# EasyEDA Pro project ProPrj_DBE MosFet_15F_2025-01-06.epro

# Schematic DBE MosFet
Board Name: DBE MosFet; Create Date: 2024-11-29; Page Name: DBE PCB; Project Name: DBE MosFet_15F; Schematic Name: DBE MosFet; Update Date: 2024-11-30; Add into BOM: yes; Company: BarBarian; Convert to PCB: yes; Date: 2024-05-22; Draw By: syncbart; REV: 1.4; Sheet: 1/1
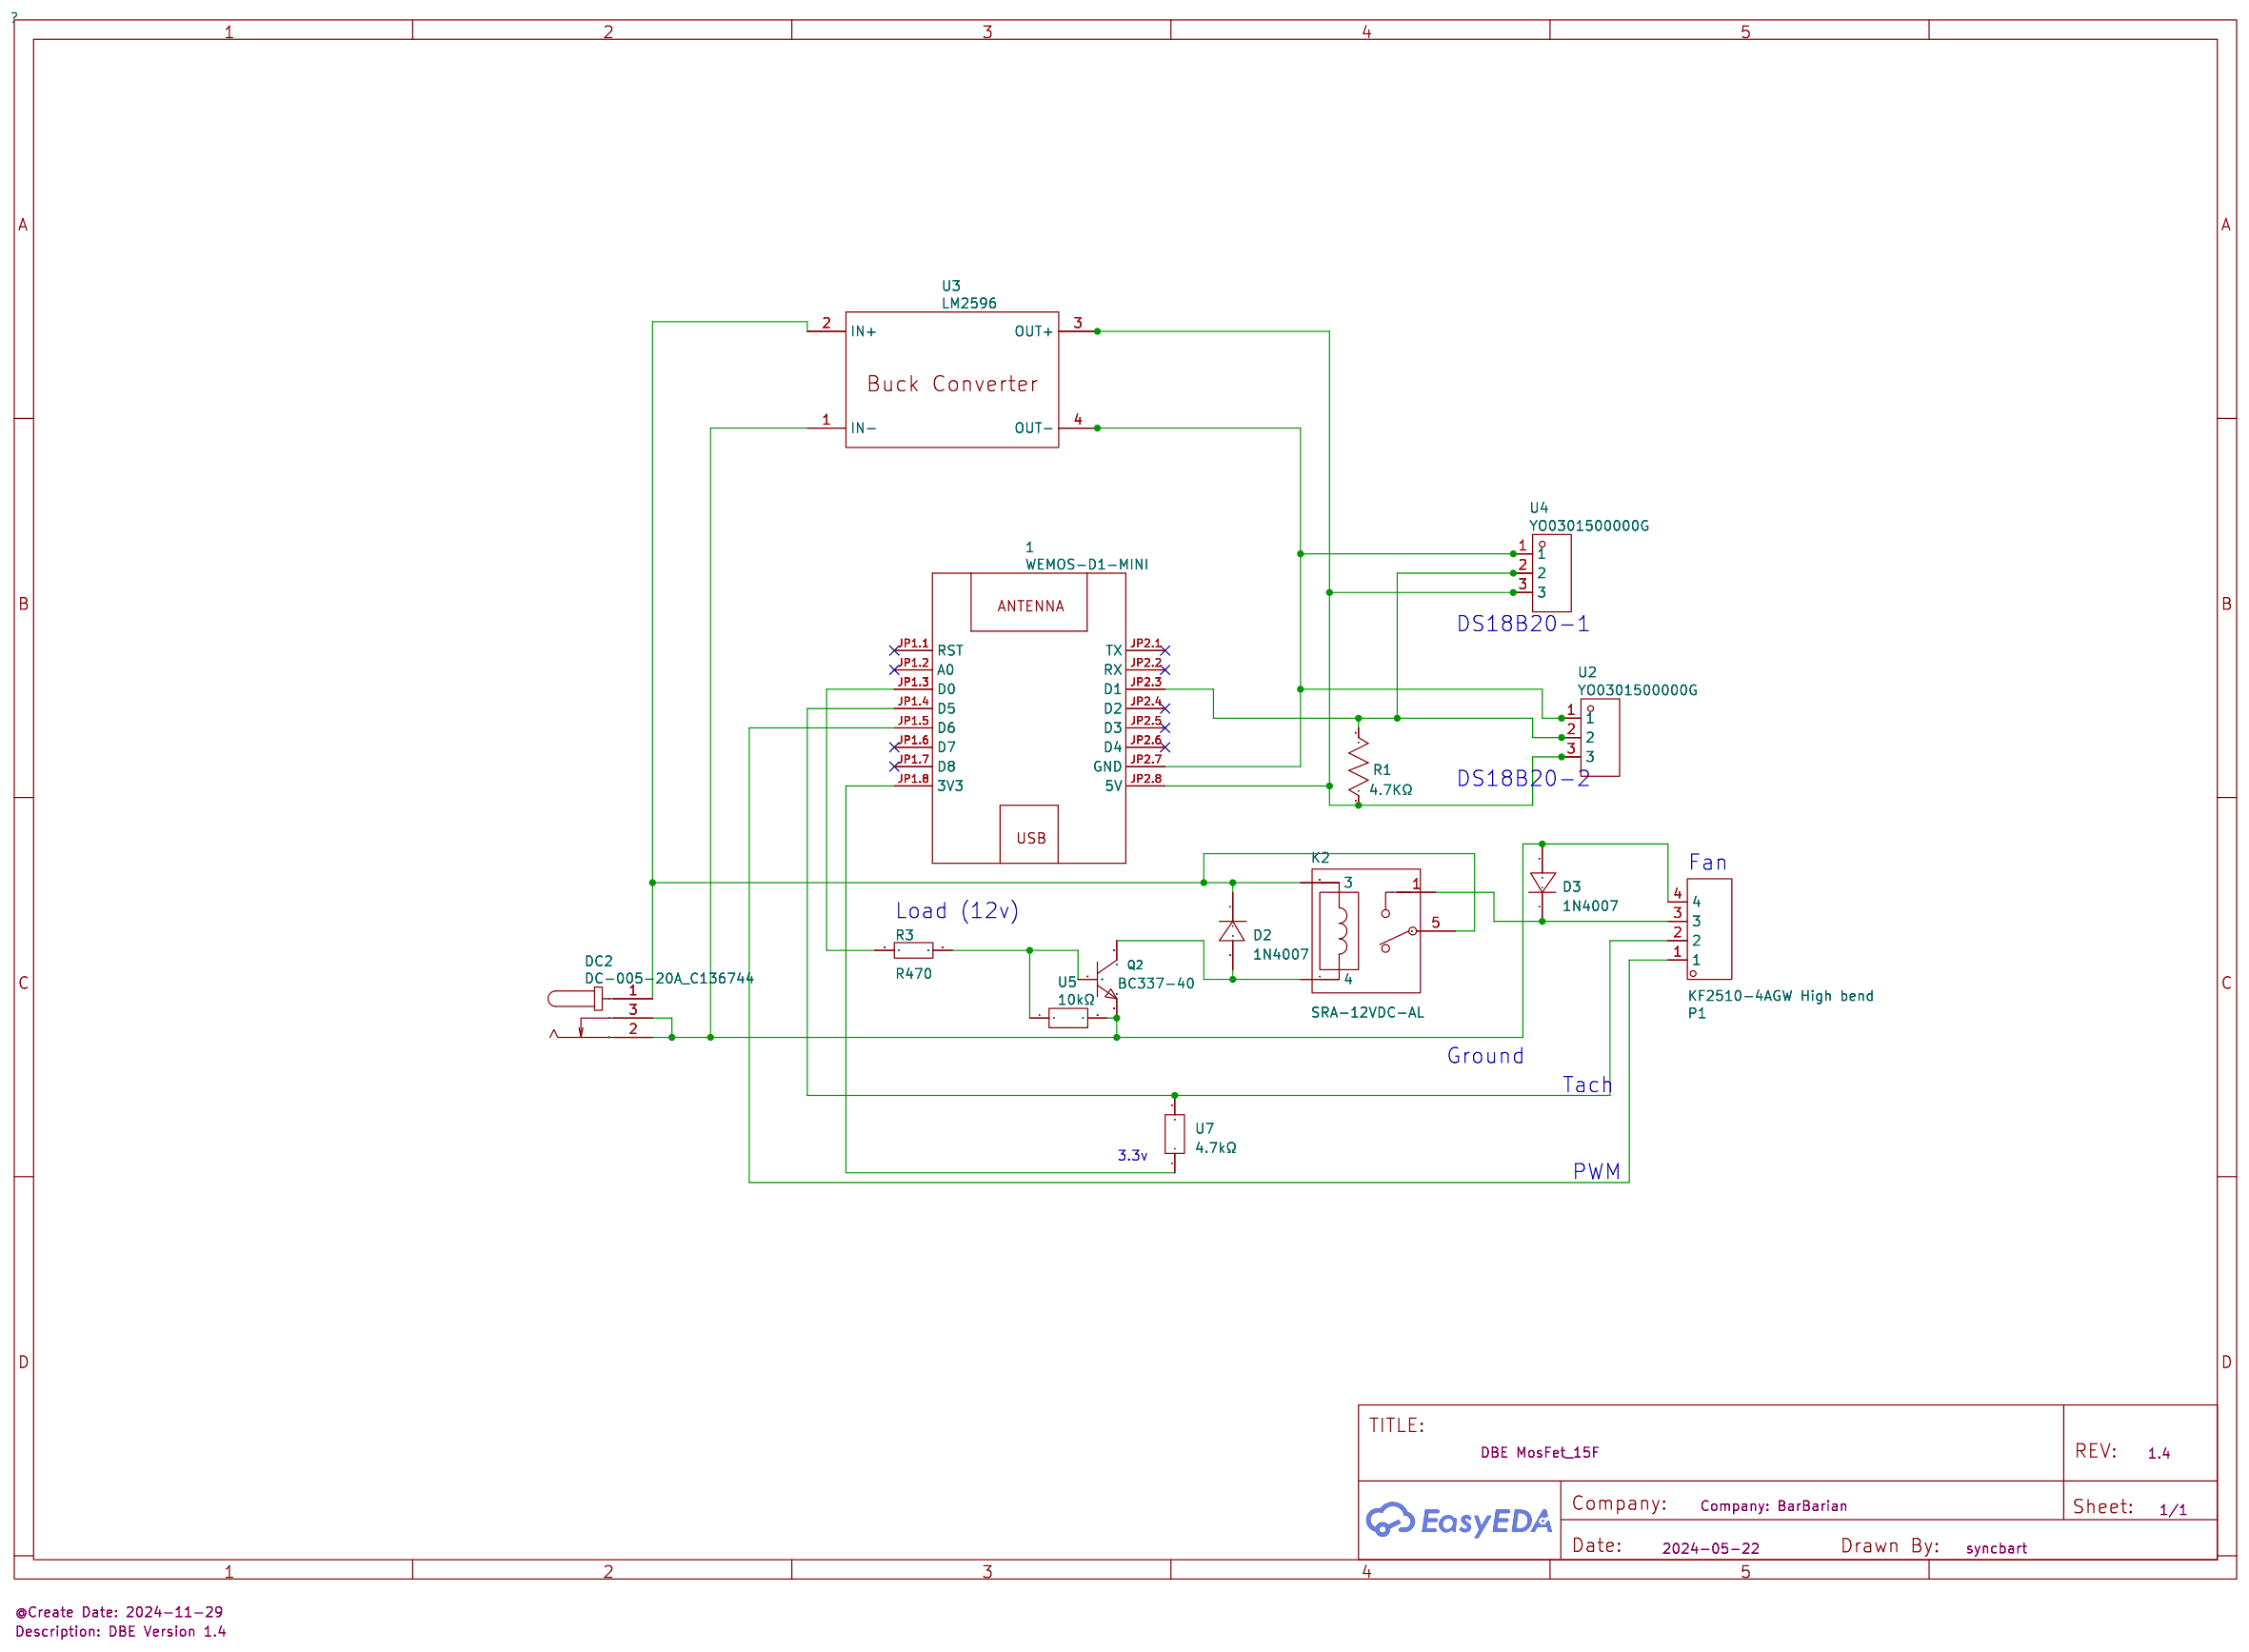
[diagram p0: schematic sheet]

## Parts
1  WEMOS-D1-MINI  [WEMOS-D1-MINI]
D2  1N4007  [DO-41_BD2.4-L4.7-P8.70-D0.9-RD]
D3  1N4007  [DO-41_BD2.4-L4.7-P8.70-D0.9-RD]
DC2  DC-005-20A_C136744  [DC-IN-TH_DC-005-20A]
K2  SRA-12VDC-AL  [RELAY-TH_SRA-XXVDC-AL]
P1  KF2510-4AGW High bend  [CONN-TH_KF2510-4AGW]
Q2  BC337-40  [TO-92-3_L4.9-W3.7-P1.27-L]
R1  4.7KΩ  [R0603]
R3  300mΩ  [R2512]
U2  YO0301500000G  [CONN-TH_YO0301500000G]
U3  LM2596  [LM2596]
U4  YO0301500000G  [CONN-TH_YO0301500000G]
U5  10kΩ  [R1206]
U7  4.7kΩ  [RES-TH_BD2.4-L6.3-P10.30-D0.6]

## Library data of the parts
1 = WEMOS-D1-MINI
D2 D3 = 1N4007: Supplier: LCSC; Manufacturer: ST(先科); Supplier Part: C106903; JLCPCB Part Class: Extended Part
DC2 = DC-005-20A_C136744: Supplier: LCSC; Manufacturer: 韩国韩荣; Manufacturer Part: DC-005-20A; Supplier Part: C136744; JLCPCB Part Class: Extended Part
K2 = SRA-12VDC-AL: Coil Voltage:12V Coil Type:非极化-单线圈 Pin Number:4 Contact Form:一组常开:1A(SPST-常开) Maximum Switching Current:10A Maximum Switching Voltage:125V@AC Coil Rated Power:600mW Contact Rating:20A@14VAC；10A@125VAC Coil Resistance:240Ω Operate Time:10ms Release Time:10; Supplier: LCSC; Manufacturer: 松乐; Supplier Part: C86414; JLCPCB Part Class: Extended Part; LCSC Part Name: SRA-12VDC-AL 黑色; Supplier Footprint: 插件,12.4x16mm; Datasheet: https://atta.szlcsc.com/upload/public/pdf/source/20180525/C86414_647190E70CCED65E88773AC191420885.pdf; Coil Voltage: 12V; Coil Type: 非极化-单线圈; Pin Number: 4; Contact Form: 一组常开:1A(SPST-常开); Maximum Switching Current: 10A; Maximum Switching Voltage: 125V@AC; Coil Rated Power: 600mW; Contact Rating: 20A@14VAC；10A@125VAC; Coil Resistance: 240Ω; Operate Time: 10ms; Release Time: 10ms; Contact Resistance: 100mΩ; Operating Temperature: -40℃~+85℃
P1 = KF2510-4AGW High bend: Supplier: LCSC; Manufacturer: BOOMELE(博穆精密); Manufacturer Part: 2510-4A高弯; Supplier Part: C61409; JLCPCB Part Class: Extended Part
Q2 = BC337-40: Transistor Type: Collector Current (Ic): Collector-Emitter Breakdown Voltage (Vceo): Power Dissipation (Pd): DC Current Gain (hFE@Ic,Vce):250@100mA,1V DC Current Gain (hFE@Ic,Vce):250@100mA,1V Transition Frequency (fT):210MHz Collector Cut-Off Current (Ic; LCSC Part Name: NPN 电流:800mA 耐压:45V; Supplier Part: C713611; Manufacturer: LGE(鲁光); Supplier Footprint: TO-92-3; JLCPCB Part Class: Extended Part; Datasheet: https://atta.szlcsc.com/upload/public/pdf/source/20200731/C713609_2BF9102A3EBD29C1F5C6CEBDB020064D.pdf; Supplier: LCSC; DC Current Gain (hFE@Ic,Vce): 250@100mA,1V; Transition Frequency (fT): 210MHz; Collector Cut-Off Current (Icbo): 100nA; Collector-Emitter Saturation Voltage (VCE(sat)@Ic,Ib): 700mV@500mA,50mA
R1 = 4.7KΩ
R3 = SR73W3ATTER300F: Resistance: Tolerance:±1% Tolerance:±1% Power(Watts): Temperature Coefficient:±100ppm/℃ Temperature Coefficient:±100ppm/℃; LCSC Part Name: 300mΩ ±1% 1W; Supplier Part: C186683; Manufacturer: KOA; Supplier Footprint: 2512; JLCPCB Part Class: Extended Part; Datasheet: https://atta.szlcsc.com/upload/public/pdf/source/20180412/C186696_56DBC868BCE53E89FE8EB87A2B584B46.pdf; Supplier: LCSC; Tolerance: ±1%; Temperature Coefficient: ±100ppm/℃
U2 U4 = YO0301500000G: Supplier: LCSC; Supplier Part: C2683167; Manufacturer: Amphenol; JLCPCB Part Class: Extended Part; link: https://lcsc.com/eda_search?q=C2683167&amp;%26type=1&amp;ref=editor
U3 = LM2596
U5 = 10kΩ: Supplier: LCSC; Supplier Part: C5141115; Manufacturer: RALEC(旺诠); Manufacturer Part: RTX061002BDTP
U7 = MFR-25FBF52-13K3: Type:Metal Film Resistors Resistance: Tolerance:±1% Tolerance:±1% Power(Watts):250mW Temperature Coefficient:±100ppm/℃ Temperature Coefficient:±100ppm/℃ Operating Temperature Range:-55℃~+155℃ Operating Temperature Range:-55℃~+155℃; LCSC Part Name: 金属膜电阻 13.3kΩ ±1% 250mW; Supplier Part: C3429539; Manufacturer: YAGEO(国巨); Supplier Footprint: 插件,D2.4xL6.3mm; JLCPCB Part Class: Extended Part; Datasheet: https://atta.szlcsc.com/upload/public/pdf/source/20231121/B79DF093C3343C1C7D20BECE94D94E07.pdf; Supplier: LCSC; Type: Metal Film Resistors; Tolerance: ±1%; Power(Watts): 250mW; Temperature Coefficient: ±100ppm/℃; Operating Temperature Range: -55℃~+155℃

## Nets
$1N1: 1.JP2.3(D1) R1.2 U2.2 U4.2
$1N1389: 1.JP1.3(D0) R3.1
$1N1762: 1.JP1.5(D6) P1.1
$1N1850: 1.JP2.8(5V) R1.1 U2.3 U3.3(OUT+) U4.3
$1N2807: Q2.2(B) R3.2 U5.1
$1N3125: 1.JP1.8(3V3) U7.1
$1N3338: 1.JP2.7(GND) U2.1 U3.4(OUT-) U4.1
$1N4493: D3.1(K) K2.1 P1.3
$1N5771: D3.2(A) DC2.2 DC2.3 P1.4 Q2.3(E) U3.1(IN-) U5.2
$1N5826: 1.JP1.4(D5) P1.2 U7.2
$1N6416: D2.1(K) DC2.1 K2.3 K2.5 U3.2(IN+)
$1N6420: D2.2(A) K2.4 Q2.1(C)

Not connected (* = marked no-connect by the designer): 1 JP1.1(RST)* JP1.2(A0)* JP1.6(D7)* JP1.7(D8)* JP2.1(TX)* JP2.2(RX)* JP2.4(D2)* JP2.5(D3)* JP2.6(D4)*

## Notes on the sheet
- DS18B20-1
- DS18B20-2
- Fan
- Load (12v)
- Ground
- Tach
- 3.3v
- PWM

# Board PCB_DBE MosFet_6
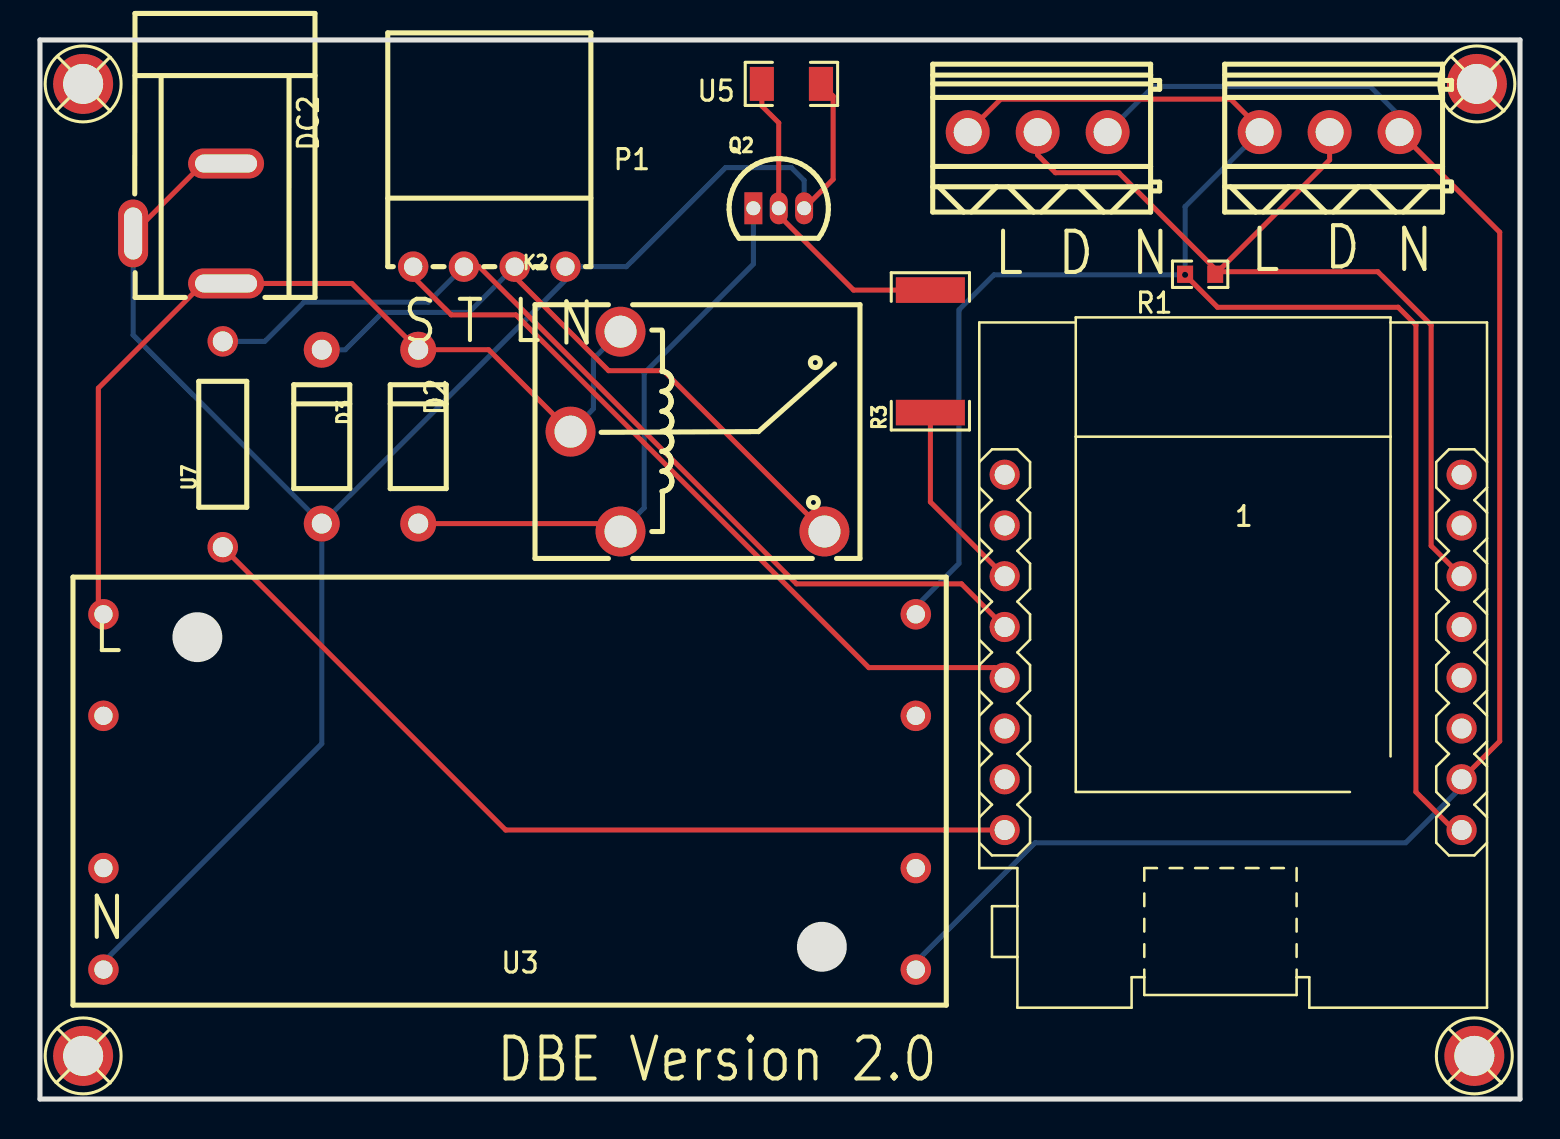
[diagram p1: board, top side]
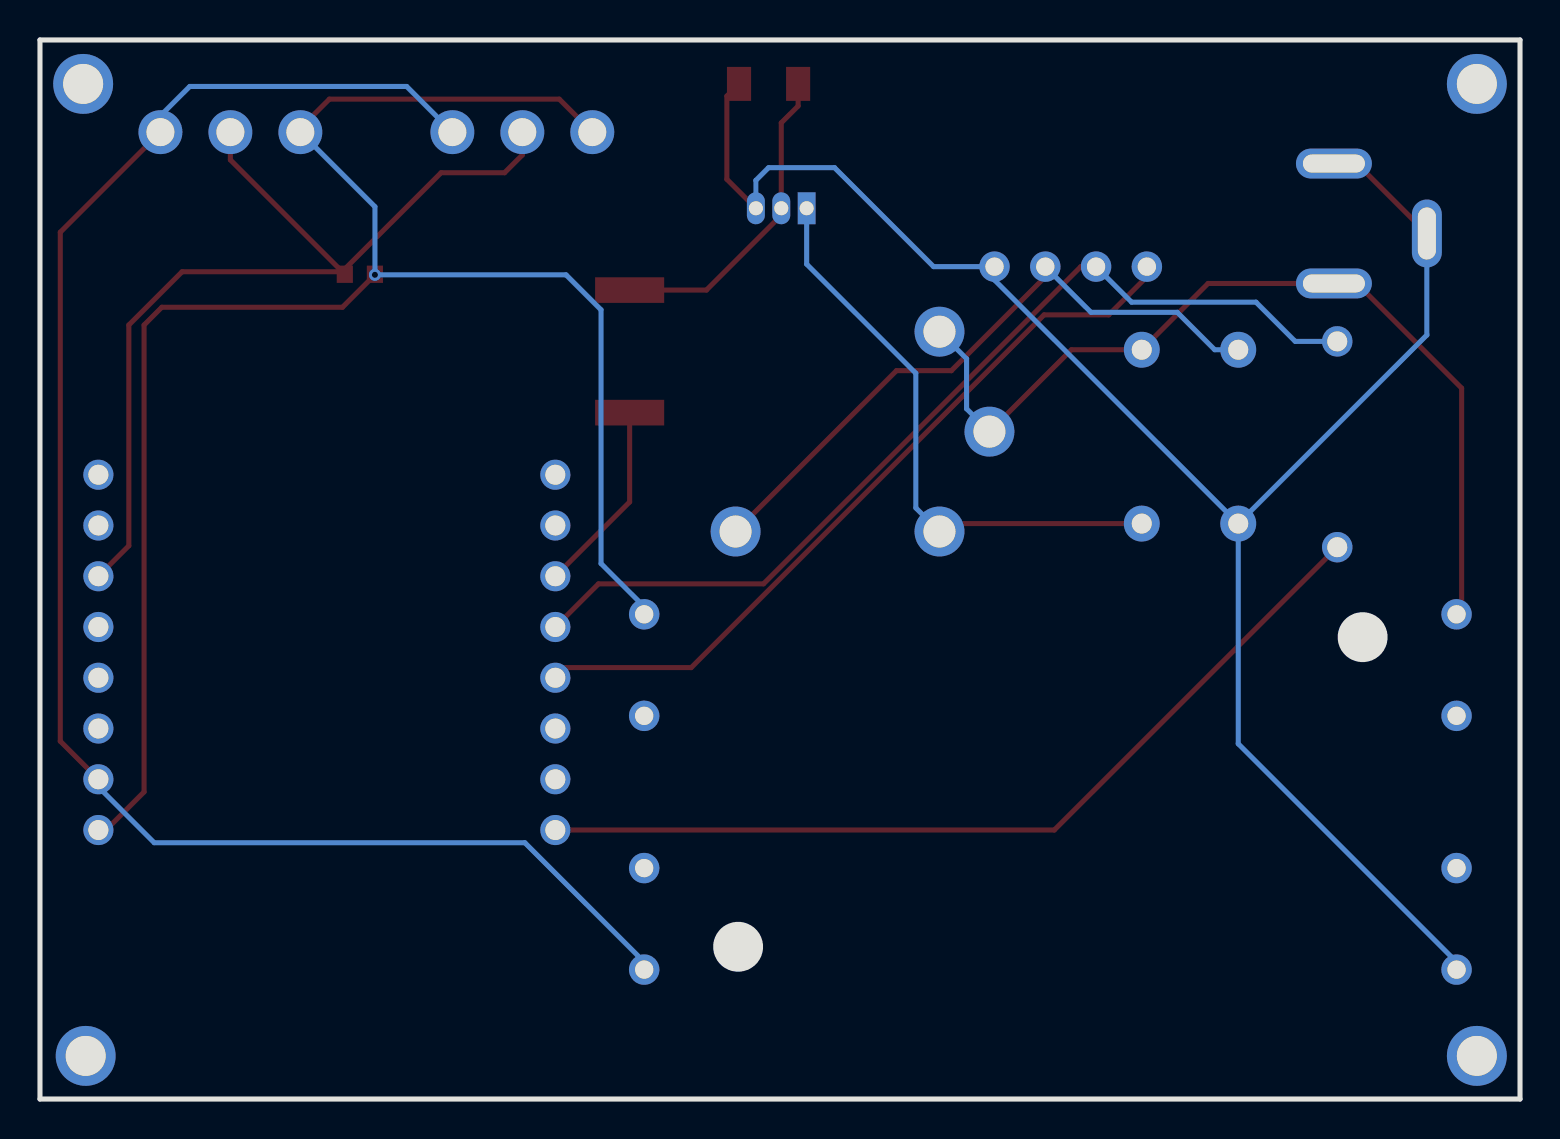
[diagram p2: board, bottom side, seen from below]

Outline 74.04 x 53 mm; copper layers: Top Layer, Bottom Layer. Coordinates in mm from the lower left corner of the outline.
Outline path: 0,53 74.04,53 74.04,0 0,0 0,53
Stack: Top Layer 0.035mm / Dielectric1 1.51mm FR4 er 4.5 / Bottom Layer 0.035mm

## Design rules (mm)
spacing Default (default): track to track 0.152, other pairs 0 to 0.152
track width Default (default): min 0.254, default 0.254, max 25.4
differential pair differentialPair (default): width min 0.127, default 0.254, max 2.54; gap min 0.152, default 0.152
via Default (default): diameter min 0.61, default 0.61, max 100.025; hole min 0.305, default 0.305, max 59.995

## Placement (name value [footprint] x y rotation side)
1  -  [WEMOS-D1-MINI]  59.69 21.72 0 top
D2  1N4007  [DO-41_BD2.4-L4.7-P8.70-D0.9-RD]  18.92 33.15 270 top
D3  1N4007  [DO-41_BD2.4-L4.7-P8.70-D0.9-RD]  14.1 33.15 270 top
DC2  DC-005-20A_C136744  [DC-IN-TH_DC-005-20A]  6.98 43.81 270 top
K2  SRA-12VDC-AL  [RELAY-TH_SRA-XXVDC-AL]  32.89 33.4 0 top
P1  KF2510-4AGW High bend  [CONN-TH_KF2510-4AGW]  22.48 41.66 0 top
Q2  BC337-40  [TO-92-3_L4.9-W3.7-P1.27-L]  36.96 44.58 0 top
R1  4.7KΩ  [R0603]  58.04 41.28 0 top
R3  300mΩ  [R2512]  44.54 37.42 90 top
SCREW1  -  [Screw-Hole-M2]  2.16 50.8 0 top
SCREW1#2  -  [Screw-Hole-M2]  71.75 2.16 0 top
SCREW1#3  -  [Screw-Hole-M2]  71.88 50.8 0 top
SCREW1#4  -  [Screw-Hole-M2]  2.16 2.16 0 top
U2  YO0301500000G  [CONN-TH_YO0301500000G]  64.52 48.39 180 top
U3  -  [LM2596]  3.17 6.48 0 top
U4  YO0301500000G  [CONN-TH_YO0301500000G]  49.91 48.39 180 top
U5  10kΩ  [R1206]  37.59 50.8 0 top
U7  4.7kΩ  [RES-TH_BD2.4-L6.3-P10.30-D0.6]  9.14 32.77 90 top

## Footprints (pads in the part's own frame, mm; a bottom-side part is the same pattern mirrored in y, then rotated)
CONN-TH_KF2510-4AGW
  round 1.524 hole 0.914: 1(-3.81,0) 2(-1.27,0) 3(1.27,0) 4(3.81,0)
CONN-TH_YO0301500000G
  round 2.2 hole 1.4: 1(-3.5,0) 2(-0.001,0) 3(3.5,0)
DC-IN-TH_DC-005-20A
  oval 1.5x3.8 hole 0.9x3.1: 1(3,2.325) 2(-3,2.325)
  oval 3.4x1.5 hole 2.6x0.9: 3(0.5,-2.325)
DO-41_BD2.4-L4.7-P8.70-D0.9-RD
  round 1.8 hole 1: 1(-4.35,0) 2(4.35,0)
LM2596
  round 1.524 hole 0.914: 1(0,0) 2(0,17.78) 3(40.64,17.78) 4(40.64,0) 7(0,5.08) 8(0,12.7) 9(40.64,12.7) 10(40.64,5.08)
R0603
  rect 0.806x0.864 smd: 1(-0.753,0) 2(0.753,0)
R1206
  rect 1.208x1.701 smd: 1(-1.479,0) 2(1.479,0)
R2512
  rect 1.282x3.456 smd: 1(-3.067,0) 2(3.067,0)
RELAY-TH_SRA-XXVDC-AL
  round 2.5 hole 1.6: 1(6.35,-5) 3(-3.85,5) 4(-3.85,-5) 5(-6.35,-0.002)
RES-TH_BD2.4-L6.3-P10.30-D0.6
  round 1.524 hole 1: 1(-5.15,0) 2(5.15,0)
Screw-Hole-M2
  round 3 hole 2: 1(0,0)
TO-92-3_L4.9-W3.7-P1.27-L
  rect 0.9x1.6 hole 0.7: 1(-1.27,0)
  oval 0.9x1.6 hole 0.7: 2(0,0) 3(1.27,0)
WEMOS-D1-MINI
  round 1.508 hole 1x1: JP1.1(-11.43,9.525) JP1.2(-11.43,6.985) JP1.3(-11.43,4.445) JP1.4(-11.43,1.905) JP1.5(-11.43,-0.635) JP1.6(-11.43,-3.175) JP1.7(-11.43,-5.715) JP1.8(-11.43,-8.255) JP2.1(11.43,9.525) JP2.2(11.43,6.985) JP2.3(11.43,4.445) JP2.4(11.43,1.905) JP2.5(11.43,-0.635) JP2.6(11.43,-3.175) JP2.7(11.43,-5.715) JP2.8(11.43,-8.255)

## Nets
As in the schematic.

Pads without a net: 1 JP1.1 JP1.2 JP1.6 JP1.7 JP2.1 JP2.2 JP2.4 JP2.5 JP2.6; SCREW1 1; SCREW1#2 1; SCREW1#3 1; SCREW1#4 1; U3 7 8 9 10

## Via types
v1: diameter 0.61, hole 0.305, Top Layer to Bottom Layer, 1 via

## Routing (per net, layer and track width the routed paths; a pad name or vN(x,y) marks a point on that pad's centre or on a via; arc(x,y) is an arc through that point)
$1N1: length 47
  Top Layer w0.254: 64.52,48.39 64.52,47 58.92,41.41 ; U4.2 49.91,47.24 50.8,46.36 53.97,46.36 58.92,41.41 ; 58.92,41.41 58.93,41.4 66.93,41.4 69.6,38.73 69.6,27.69 1.JP2.3 ; 58.92,41.41 R1.2
$1N1389: length 9.7
  Top Layer w0.254: R3.1 44.54,29.88 1.JP1.3
$1N1762: length 38.4
  Top Layer w0.254: 1.JP1.5 47.75,21.59 41.46,21.59 23.81,39.24 20.57,39.24 18.67,41.15 P1.1
$1N1850: length 92
  Top Layer w0.254: 1.JP2.8 70.74,13.46 68.83,15.37 68.83,38.73 67.95,39.62 58.91,39.62 v1(57.29,41.25) ; U4.3 48.06,50.04 59.56,50.04 61.02,48.58 U2.3
  Bottom Layer w0.254: 43.56,24.38 45.97,26.8 45.97,39.5 47.72,41.25 v1(57.29,41.25) 57.29,44.66 U2.3
$1N2807: length 16.1
  Top Layer w0.254: U5.1 36.11,49.7 36.96,48.85 Q2.2 36.96,44.23 40.7,40.48 R3.2
$1N3125: length 45
  Top Layer w0.254: U7.1 23.3,13.46 1.JP1.8
$1N3338: length 83.9
  Top Layer w0.254: U2.1 73.02,43.38 73.02,17.91 1.JP2.7
  Bottom Layer w0.254: U4.1 55.7,50.67 66.55,50.67 68.02,49.2 U2.1 ; 1.JP2.7 71.12,15.62 68.33,12.83 49.78,12.83 43.56,6.6
$1N4493: length 32.7
  Top Layer w0.254: K2.1 31.2,36.45 28.45,36.45 23.75,41.15 P1.3
  Bottom Layer w0.254: P1.3 21.46,39.37 17.14,39.37 15.27,37.5 D3.1
$1N5771: length 92
  Top Layer w0.254: DC2.2 8.16,46.81 DC2.3 ; Q2.3 39.68,46.03 39.68,50.19 U5.2
  Bottom Layer w0.254: D3.2 4.66,38.23 DC2.3 ; D3.2 26.29,40.99 P1.4 29.34,41.66 34.29,46.61 37.59,46.61 38.23,45.97 Q2.3 ; D3.2 14.1,17.78 2.92,6.6
$1N5826: length 48.1
  Top Layer w0.254: P1.2 21.97,41.66 37.85,25.78 46.1,25.78 1.JP1.4
  Bottom Layer w0.254: 9.14,37.92 11.25,37.92 13.21,39.88 19.43,39.88 P1.2
$1N6416: length 46.1
  Top Layer w0.254: 2.92,24.38 2.92,35.58 8.16,40.81 DC2.1 15.61,40.81 D2.1 22.45,37.5 K2.5
  Bottom Layer w0.254: K2.5 27.69,34.54 27.69,37.04 K2.3
$1N6420: length 29.2
  Top Layer w0.254: K2.4 28.65,28.8 D2.2
  Bottom Layer w0.254: K2.4 30.23,29.58 30.23,36.32 35.69,41.78 Q2.1

## Text on the board
Top Silkscreen Layer: N | L | S | T | D | DBE Version 2.0
